# Altium schematic sheet Core Power.SchDoc
size A4; SheetNumber: 3; SheetTotal: 9
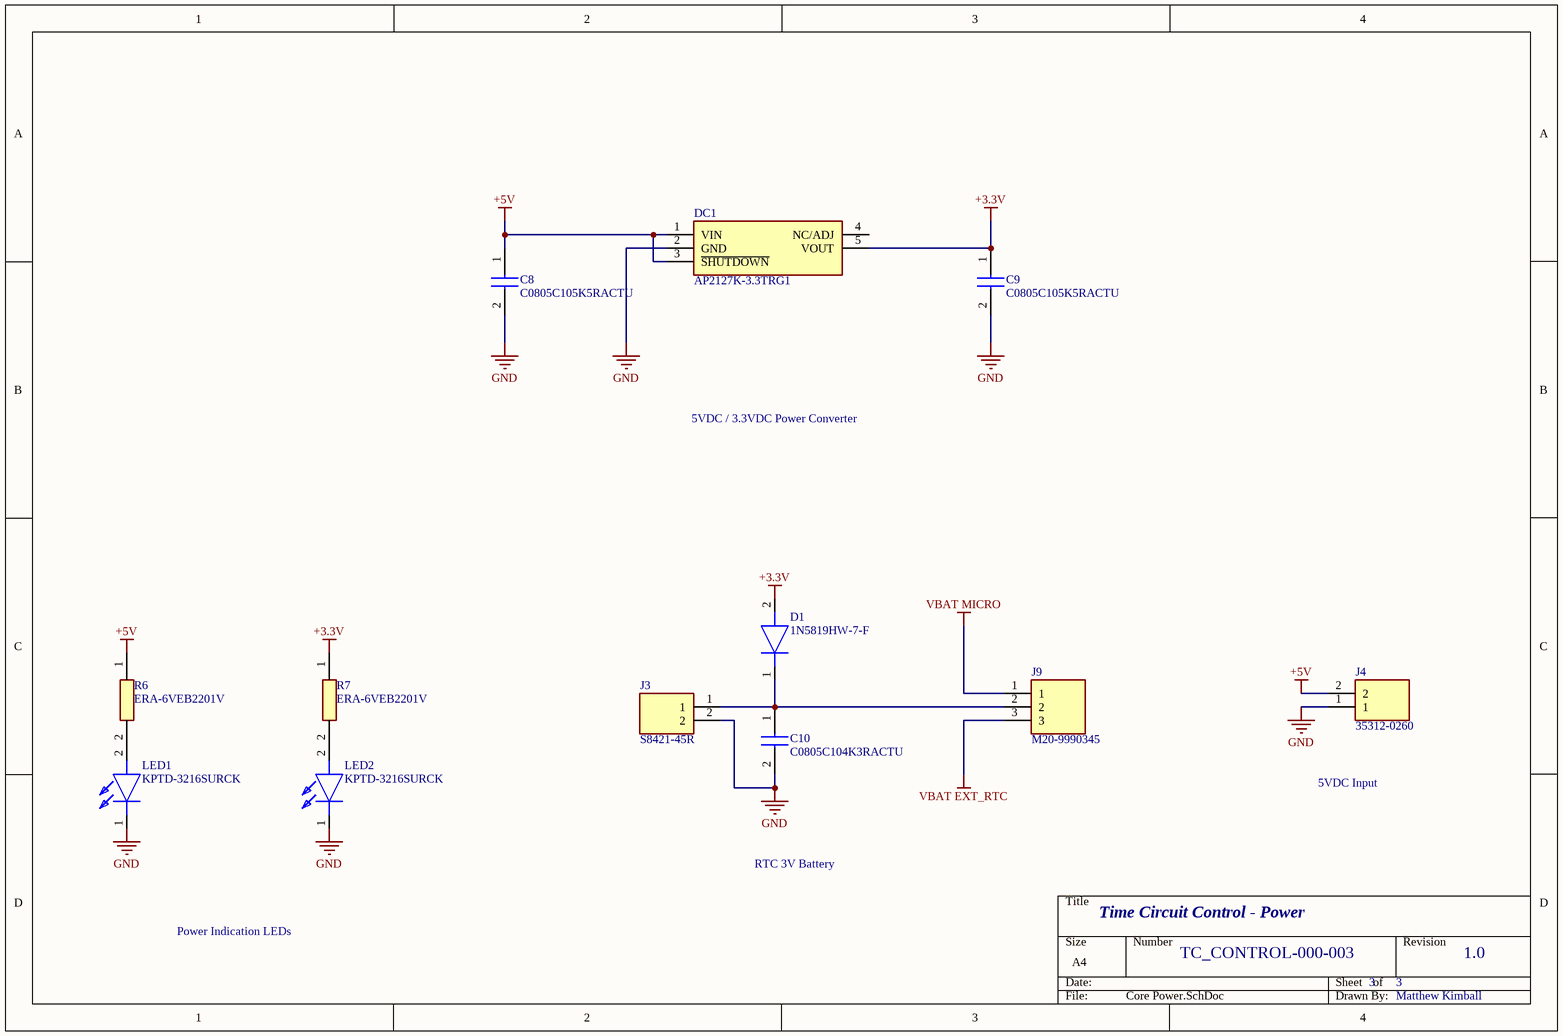
[diagram p0: Core Power.SchDoc]

## Parts
C8  C0805C105K5RACTU  [CAPC2012X140N]
C9  C0805C105K5RACTU  [CAPC2012X140N]
C10  C0805C104K3RACTU  [CAPC2012X88N]
D1  1N5819HW-7-F  [SOD3716X125N]
DC1  AP2127K-3.3TRG1  [SOT95P282X145-5N]
J3  S8421-45R  [S8421-45R_1]
J4  35312-0260  [SHDR2W64P0X250_1X2_746X650X700P]
J9  M20-9990345  [HDRV3W64P0X254_1X3_762X254X864P]
LED1  KPTD-3216SURCK  [KPTD3216SURCK]
LED2  KPTD-3216SURCK  [KPTD3216SURCK]
R6  ERA-6VEB2201V  [RESC2012X65N]
R7  ERA-6VEB2201V  [RESC2012X65N]

## Nets
+3.3V: C9.1 D1.2(A) DC1.5(VOUT) R7.1
+5V: C8.1 DC1.1(VIN) DC1.3(~{SHUTDOWN}) J4.2 R6.1
GND: C8.2 C9.2 C10.2 DC1.2(GND) J3.2 J4.1 LED1.1(K) LED2.1(K)
VBAT EXT_RTC: J9.3
VBAT MICRO: J9.1
NetC10_1: C10.1 D1.1(K) J3.1 J9.2
NetLED1_2: LED1.2(A) R6.2
NetLED2_2: LED2.2(A) R7.2

Not connected (* = marked no-connect by the designer): DC1 4(NC/ADJ)

## Notes on the sheet
- 5VDC / 3.3VDC Power Converter
- 5VDC Input
- RTC 3V Battery
- Time Circuit Control - Power
- Power Indication LEDs
- TC_CONTROL-000-003
- 3
- 1.0
- Matthew Kimball

## Library data of the parts
C8 C9 = C0805C105K5RACTU: Capacitor; Manufacturer_Name: Kemet; Datasheet Link: http://www.kemet.com/docfinder?Partnumber=C0805C105K5RACTU; Height: 1.4mm; Manufacturer_Part_Number: C0805C105K5RACTU; Mouser Part Number: 80-C0805C105K5R; Mouser Price/Stock: https://www.mouser.co.uk/ProductDetail/KEMET/C0805C105K5RACTU/?qs=iP0bYSAMAFrBrUflcErrLQ%3D%3D; Arrow Part Number: C0805C105K5RACTU; Arrow Price/Stock: https://www.arrow.com/en/products/c0805c105k5ractu/kemet-corporation
C10 = C0805C104K3RACTU: Capacitor; Manufacturer_Name: Kemet; Datasheet Link: https://componentsearchengine.com/Datasheets/2/C0805C104K3RACTU.pdf; Height: 0.88mm; Manufacturer_Part_Number: C0805C104K3RACTU; Mouser Part Number: 80-C0805C104K3R; Mouser Price/Stock: https://www.mouser.co.uk/ProductDetail/KEMET/C0805C104K3RACTU?qs=zZwvocWqSRjmUvfNxkIN%2Fg%3D%3D; Arrow Part Number: C0805C104K3RACTU; Arrow Price/Stock: https://www.arrow.com/en/products/c0805c104k3ractu/kemet-corporation
D1 = 1N5819HW-7-F: Diode; Manufacturer_Name: MULTICOMP; Datasheet Link: http://www.farnell.com/datasheets/1693720.pdf; Height: 1.25mm; Manufacturer_Part_Number: 1N5819HW-7-F
DC1 = AP2127K-3.3TRG1: Integrated Circuit; Manufacturer_Name: Diodes Inc.; Datasheet Link: https://www.diodes.com/assets/Datasheets/AP2127.pdf; Height: 1.45mm; Manufacturer_Part_Number: AP2127K-3.3TRG1; Mouser Part Number: 621-AP2127K-3.3TRG1; Mouser Price/Stock: https://www.mouser.co.uk/ProductDetail/Diodes-Incorporated/AP2127K-33TRG1?qs=x6A8l6qLYDCeAxisWuFs5g%3D%3D; Arrow Part Number: AP2127K-3.3TRG1; Arrow Price/Stock: https://www.arrow.com/en/products/ap2127k-3.3trg1/diodes-incorporated
J3 = S8421-45R: Connector; Manufacturer_Name: Harwin; Datasheet Link: https://datasheet.datasheetarchive.com/originals/distributors/Datasheets-DGA1/157350.pdf; Manufacturer_Part_Number: S8421-45R; Mouser Part Number: 855-S8421-45R; Mouser Price/Stock: https://www.mouser.co.uk/ProductDetail/Harwin/S8421-45R?qs=Qom7kyPojXY6z0Gmx3V3RQ%3D%3D
J4 = 35312-0260: Connector; Manufacturer_Name: Molex; Datasheet Link: https://www.molex.com/pdm_docs/sd/353120260_sd.pdf; Height: 7mm; Manufacturer_Part_Number: 35312-0260; Mouser Part Number: 538-35312-0260; Mouser Price/Stock: https://www.mouser.co.uk/ProductDetail/Molex/35312-0260?qs=yk4OKw9K9iIhFPrGnuA8uA%3D%3D
J9 = M20-9990345: Connector; Manufacturer_Name: Harwin; Description: 2.54 pitch SIL vertical PC tail pin header; Datasheet Link: https://cdn.harwin.com/pdfs/M20-999.pdf; Height: 8.64mm; Manufacturer_Part_Number: M20-9990345; Mouser Part Number: 855-M20-9990345; Mouser Price/Stock: https://www.mouser.co.uk/ProductDetail/Harwin/M20-9990345?qs=ulE8k0yEMYbl6ZPCtNdmpA%3D%3D
LED1 LED2 = KPTD-3216SURCK: LED; Manufacturer_Name: Kingbright; Datasheet Link: https://www.mouser.com/catalog/specsheets/kingbright_kbec-s-a0008346162-1.pdf; Height: 1.8mm; Manufacturer_Part_Number: KPTD-3216SURCK; Mouser Part Number: N/A; Mouser Price/Stock: https://www.mouser.com/Search/Refine.aspx?Keyword=N%2FA; Arrow Part Number: KPTD-3216SURCK; Arrow Price/Stock: https://www.arrow.com/en/products/kptd-3216surck/kingbright
R6 R7 = ERA-6VEB2201V: Resistor; Manufacturer_Name: Panasonic; Datasheet Link: https://www.mouser.de/datasheet/2/315/Panasonic_Resistor_Thin_Film_(ERA-xV_2c_ERA-xK_Ser-1815278.pdf; Height: 0.65mm; Manufacturer_Part_Number: ERA-6VEB2201V; Mouser Part Number: 667-ERA-6VEB2201V; Mouser Price/Stock: https://www.mouser.co.uk/ProductDetail/Panasonic/ERA-6VEB2201V?qs=rI7uf1IzohTwRzvkINayfg%3D%3D; Arrow Part Number: ERA-6VEB2201V; Arrow Price/Stock: https://www.arrow.com/en/products/era-6veb2201v/panasonic